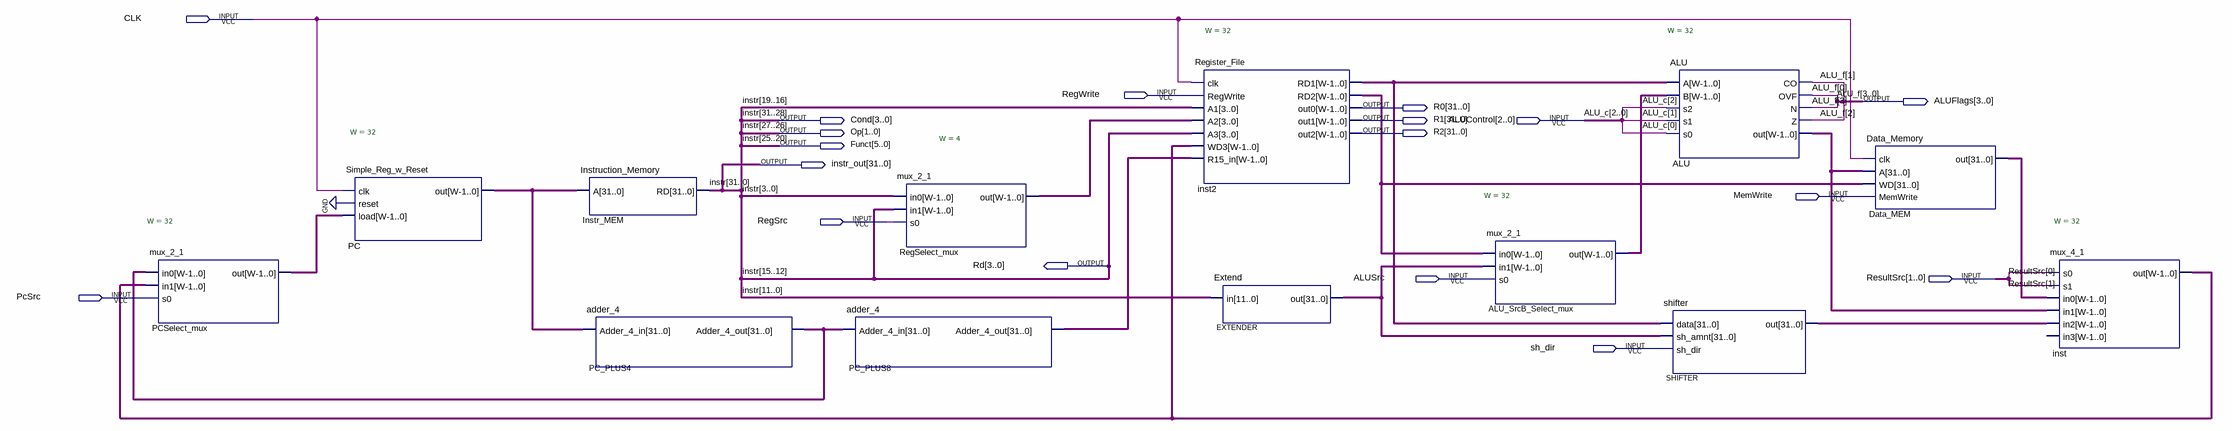
[diagram p0: schematic sheet]
// Quartus schematic Datapath.bdf as structural Verilog: 13 symbols, 18 pins
module Datapath (
  input  CLK,
  input  RegWrite,
  input  [2:0] ALUControl,
  input  MemWrite,
  input  RegSrc,
  input  ALUSrc,
  input  [1:0] ResultSrc,
  input  PcSrc,
  input  sh_dir,
  output [3:0] ALUFlags,
  output [31:0] R0,
  output [3:0] Cond,
  output [31:0] R1,
  output [1:0] Op,
  output [31:0] R2,
  output [5:0] Funct,
  output [31:0] instr_out,
  output [3:0] Rd
);

  wire [3:0] RegSelect_mux_out;
  wire [31:0] ALU_out, ALU_SrcB_Select_mux_out, Data_MEM_out, EXTENDER_out, inst2_rd1, inst2_rd2, inst_out,
       PC_out, PC_PLUS4_adder_4_out, PC_PLUS8_adder_4_out, PCSelect_mux_out, SHIFTER_out;

  mux_2_1 #(.W(32)) PCSelect_mux (.in0(PC_PLUS4_adder_4_out), .in1(inst_out), .s0(PcSrc), .out(PCSelect_mux_out));
  Simple_Reg_w_Reset #(.W(32)) PC (.clk(CLK), .reset(1'b0), .load(PCSelect_mux_out), .out(PC_out));
  Instruction_Memory Instr_MEM (.A(PC_out), .RD({Cond, instr_out[27:26], Funct, instr_out[19:0]}));
  adder_4 PC_PLUS4 (.Adder_4_in(PC_out), .Adder_4_out(PC_PLUS4_adder_4_out));
  adder_4 PC_PLUS8 (.Adder_4_in(PC_PLUS4_adder_4_out), .Adder_4_out(PC_PLUS8_adder_4_out));
  mux_2_1 #(.W(4)) RegSelect_mux (.in0(instr_out[3:0]), .in1(instr_out[15:12]), .s0(RegSrc), .out(RegSelect_mux_out));
  Register_File #(.W(32)) inst2 (
    .clk(CLK), .RegWrite(RegWrite), .A1(instr_out[19:16]), .A2(RegSelect_mux_out), .A3(instr_out[15:12]),
    .WD3(inst_out), .R15_in(PC_PLUS8_adder_4_out), .RD1(inst2_rd1), .RD2(inst2_rd2), .out0(R0), .out1(R1),
    .out2(R2));
  Extend EXTENDER (.in(instr_out[11:0]), .out(EXTENDER_out));
  mux_2_1 #(.W(32)) ALU_SrcB_Select_mux (
    .in0(inst2_rd2), .in1(EXTENDER_out), .s0(ALUSrc), .out(ALU_SrcB_Select_mux_out));
  ALU #(.W(32)) ALU (
    .A(inst2_rd1), .B(ALU_SrcB_Select_mux_out), .s2(ALUControl[2]), .s1(ALUControl[1]), .s0(ALUControl[0]),
    .CO(ALUFlags[1]), .OVF(ALUFlags[0]), .N(ALUFlags[3]), .Z(ALUFlags[2]), .out(ALU_out));
  shifter SHIFTER (.data(inst2_rd1), .sh_amnt(EXTENDER_out), .sh_dir(sh_dir), .out(SHIFTER_out));
  Data_Memory Data_MEM (.clk(CLK), .A(ALU_out), .WD(inst2_rd2), .MemWrite(MemWrite), .out(Data_MEM_out));
  mux_4_1 #(.W(32)) inst (
    .s0(ResultSrc[0]), .s1(ResultSrc[1]), .in0(Data_MEM_out), .in1(ALU_out), .in2(SHIFTER_out), .out(inst_out));  // open: in3

  assign {instr_out[31:28], instr_out[25:20]} = {Cond, Funct};
  assign Op = instr_out[27:26];
  assign Rd = instr_out[15:12];

  // Other names for the same wires on the sheet: ALU_c[2:0] = ALUControl; ALU_f[3:0] = ALUFlags;
  //   instr[31:0] = {Cond, instr_out[27:26], Funct, instr_out[19:0]}
endmodule
